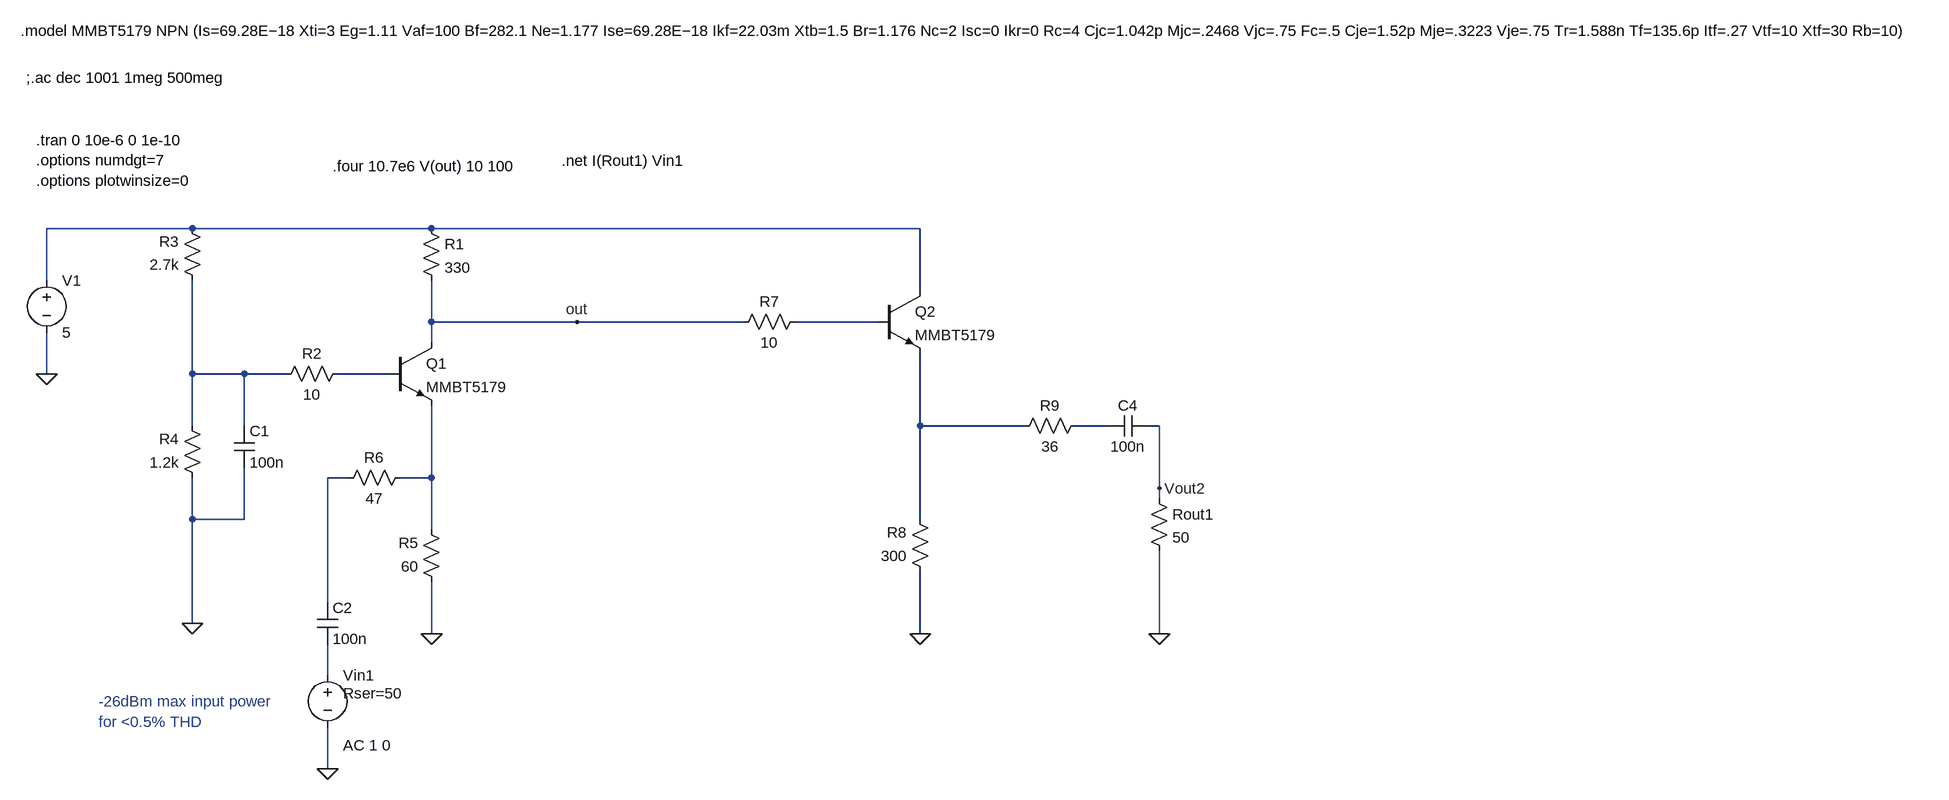
[diagram p0: schematic TIA2.asc]
TIA2.asc, the LTspice schematic file:
Version 4
SHEET 1 2284 680
WIRE -704 -304 -928 -304
WIRE -336 -304 -704 -304
WIRE 416 -304 -336 -304
WIRE -928 -224 -928 -304
WIRE 416 -208 416 -304
WIRE -336 -160 -336 -224
WIRE -112 -160 -336 -160
WIRE 144 -160 -112 -160
WIRE 352 -160 224 -160
WIRE -336 -128 -336 -160
WIRE -928 -80 -928 -144
WIRE -704 -80 -704 -224
WIRE -624 -80 -704 -80
WIRE -560 -80 -624 -80
WIRE -400 -80 -480 -80
WIRE -704 0 -704 -80
WIRE -624 0 -624 -80
WIRE 416 0 416 -112
WIRE 576 0 416 0
WIRE 704 0 656 0
WIRE 784 0 768 0
WIRE -464 80 -496 80
WIRE -336 80 -336 -32
WIRE -336 80 -384 80
WIRE 784 96 784 0
WIRE 784 112 784 96
WIRE -704 144 -704 80
WIRE -624 144 -624 64
WIRE -624 144 -704 144
WIRE 416 144 416 0
WIRE -336 160 -336 80
WIRE -496 272 -496 80
WIRE -704 304 -704 144
WIRE -336 320 -336 240
WIRE 416 320 416 224
WIRE 784 320 784 192
WIRE -496 384 -496 336
WIRE -496 528 -496 464
FLAG -928 -80 0
FLAG -704 304 0
FLAG -336 320 0
FLAG -496 528 0
FLAG 416 320 0
FLAG 784 320 0
FLAG 784 96 Vout2
FLAG -112 -160 out
SYMBOL npn -400 -128 R0
SYMATTR InstName Q1
SYMATTR Value MMBT5179
SYMBOL res -352 -320 R0
SYMATTR InstName R1
SYMATTR Value 330
SYMBOL res -464 -96 R90
WINDOW 0 0 56 VBottom 2
WINDOW 3 32 56 VTop 2
SYMATTR InstName R2
SYMATTR Value 10
SYMBOL res -688 -208 R180
WINDOW 0 36 76 Left 2
WINDOW 3 36 40 Left 2
SYMATTR InstName R3
SYMATTR Value 2.7k
SYMBOL res -688 96 R180
WINDOW 0 36 76 Left 2
WINDOW 3 36 40 Left 2
SYMATTR InstName R4
SYMATTR Value 1.2k
SYMBOL res -320 256 R180
WINDOW 0 36 76 Left 2
WINDOW 3 36 40 Left 2
SYMATTR InstName R5
SYMATTR Value 60
SYMBOL voltage -928 -240 R0
WINDOW 123 0 0 Left 0
WINDOW 39 0 0 Left 0
SYMATTR InstName V1
SYMATTR Value 5
SYMBOL cap -640 0 R0
SYMATTR InstName C1
SYMATTR Value 100n
SYMBOL cap -512 272 R0
SYMATTR InstName C2
SYMATTR Value 100n
SYMBOL voltage -496 368 R0
WINDOW 3 24 96 Invisible 2
WINDOW 123 24 124 Left 2
WINDOW 39 24 44 Left 2
SYMATTR Value SINE(0 30e-3 10.7e6)
SYMATTR Value2 AC 1 0
SYMATTR SpiceLine Rser=50
SYMATTR InstName Vin1
SYMBOL npn 352 -208 R0
SYMATTR InstName Q2
SYMATTR Value MMBT5179
SYMBOL res 240 -176 R90
WINDOW 0 0 56 VBottom 2
WINDOW 3 32 56 VTop 2
SYMATTR InstName R7
SYMATTR Value 10
SYMBOL res 432 240 R180
WINDOW 0 36 76 Left 2
WINDOW 3 36 40 Left 2
SYMATTR InstName R8
SYMATTR Value 300
SYMBOL res 560 16 R270
WINDOW 0 32 56 VTop 2
WINDOW 3 0 56 VBottom 2
SYMATTR InstName R9
SYMATTR Value 36
SYMBOL cap 768 -16 R90
WINDOW 0 0 32 VBottom 2
WINDOW 3 32 32 VTop 2
SYMATTR InstName C4
SYMATTR Value 100n
SYMBOL res 768 96 R0
SYMATTR InstName Rout1
SYMATTR Value 50
SYMBOL res -368 64 R90
WINDOW 0 0 56 VBottom 2
WINDOW 3 32 56 VTop 2
SYMATTR InstName R6
SYMATTR Value 47
TEXT -968 -608 Left 2 !.model MMBT5179 NPN (Is=69.28E−18 Xti=3 Eg=1.11 Vaf=100 Bf=282.1 Ne=1.177 Ise=69.28E−18 Ikf=22.03m Xtb=1.5 Br=1.176 Nc=2 Isc=0 Ikr=0 Rc=4 Cjc=1.042p Mjc=.2468 Vjc=.75 Fc=.5 Cje=1.52p Mje=.3223 Vje=.75 Tr=1.588n Tf=135.6p Itf=.27 Vtf=10 Xtf=30 Rb=10)
TEXT -488 -400 Left 2 !.four 10.7e6 V(out) 10 100
TEXT -944 -440 Left 2 !.tran 0 10e-6 0 1e-10\n.options numdgt=7\n.options plotwinsize=0
TEXT -960 -536 Left 2 !;.ac dec 1001 1meg 500meg
TEXT -136 -408 Left 2 !.net I(Rout1) Vin1
TEXT -848 424 Left 2 ;-26dBm max input power\nfor <0.5% THD

The netlist it stands for:
* TIA2.asc
Q1 out N004 N008 0 MMBT5179
R1 N001 out 330
R2 N004 N003 10
R3 N003 N001 2.7k
R4 0 N003 1.2k
R5 0 N008 60
V1 N001 0 5
C1 N003 0 100n
C2 N007 N009 100n
Vin1 N009 0 SINE(0 30e-3 10.7e6) AC 1 0 Rser=50
Q2 N001 N002 N005 0 MMBT5179
R7 N002 out 10
R8 0 N005 300
R9 N005 N006 36
C4 Vout2 N006 100n
Rout1 Vout2 0 50
R6 N008 N007 47
.model NPN NPN
.model PNP PNP
.lib standard.bjt
.model MMBT5179 NPN (Is=69.28E−18 Xti=3 Eg=1.11 Vaf=100 Bf=282.1 Ne=1.177 Ise=69.28E−18 Ikf=22.03m Xtb=1.5 Br=1.176 Nc=2 Isc=0 Ikr=0 Rc=4 Cjc=1.042p Mjc=.2468 Vjc=.75 Fc=.5 Cje=1.52p Mje=.3223 Vje=.75 Tr=1.588n Tf=135.6p Itf=.27 Vtf=10 Xtf=30 Rb=10)
.four 10.7e6 V(out) 10 100
.tran 0 10e-6 0 1e-10
.options numdgt=7
.options plotwinsize=0
;.ac dec 1001 1meg 500meg
.net I(Rout1) Vin1
* -26dBm max input power
* for <0.5% THD
.backanno
.end